# Altium schematic sheet TMS320F28379D.SchDoc
size Letter
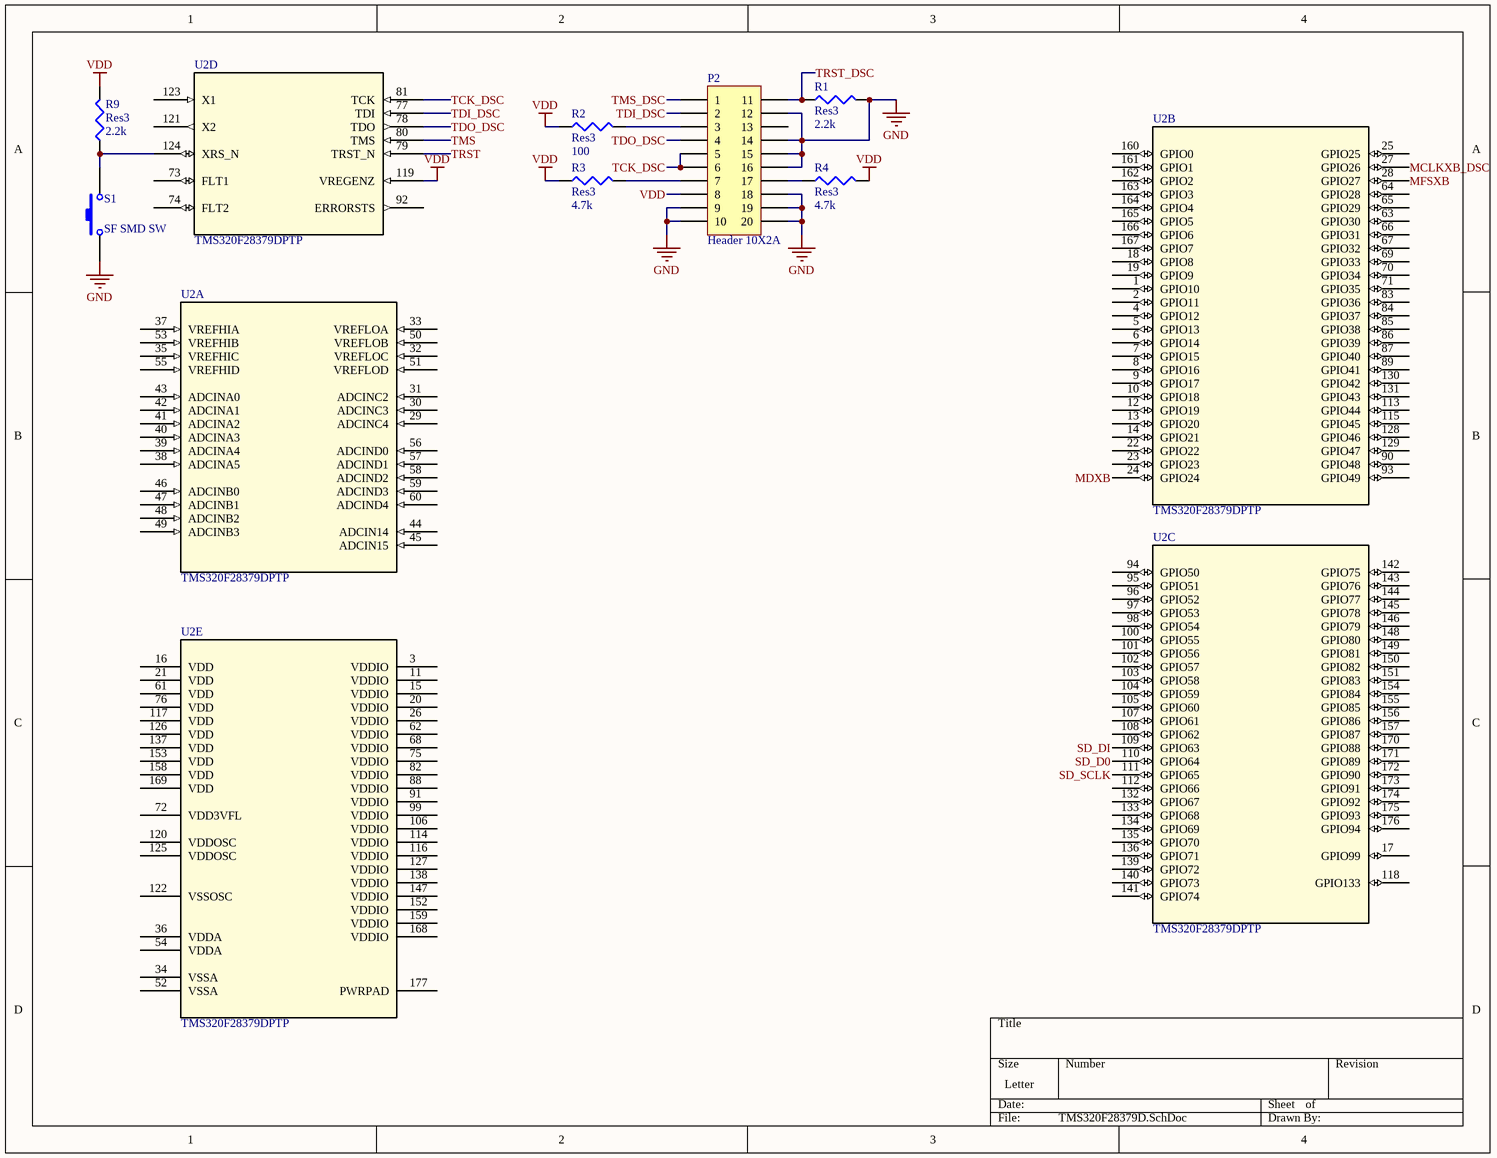
[diagram p0: TMS320F28379D.SchDoc]

## Parts
P2  Header 10X2A  [HDR2X10_CEN]
R1  Res3  value 2.2k  [J1-0603]
R2  Res3  value 100  [J1-0603]
R3  Res3  value 4.7k  [J1-0603]
R4  Res3  value 4.7k  [J1-0603]
R9  Res3  value 2.2k  [J1-0603]
S1  SF SMD SW  [SW_SMD]
U2  TMS320F28379DPTP  [PTP0176F_N]  (parts A,B,C,D,E of 5)

## Nets
GND: P2.9 P2.10 P2.12 P2.14 P2.15 P2.16 P2.18 P2.19 P2.20 R1.2 S1.1
VDD: P2.8 R2.1 R3.1 R4.2 R9.2 U2.119(VREGENZ)
MCLKXB_DSC: U2.27(GPIO26)
MDXB: U2.24(GPIO24)
MFSXB: U2.28(GPIO27)
SD_D0: U2.110(GPIO64)
SD_DI: U2.109(GPIO63)
SD_SCLK: U2.111(GPIO65)
TCK_DSC: P2.5 P2.6 U2.81(TCK)
TDI_DSC: P2.2 U2.77(TDI)
TDO_DSC: P2.4 U2.78(TDO)
TMS: U2.80(TMS)
TMS_DSC: P2.1
TRST: U2.79(TRST_N)
TRST_DSC: P2.11 R1.1
NetP2_3: P2.3 R2.2
NetP2_7: P2.7 R3.2
NetP2_17: P2.17 R4.1
NetR9_1: R9.1 S1.2 U2.124(XRS_N)

Not connected (* = marked no-connect by the designer): P2 13; U2 1(GPIO10) 2(GPIO11) 3(VDDIO) 4(GPIO12) 5(GPIO13) 6(GPIO14) 7(GPIO15) 8(GPIO16) 9(GPIO17) 10(GPIO18) 11(VDDIO) 12(GPIO19) 13(GPIO20) 14(GPIO21) 15(VDDIO) 16(VDD) 17(GPIO99) 18(GPIO8) 19(GPIO9) 20(VDDIO) 21(VDD) 22(GPIO22) 23(GPIO23) 25(GPIO25) 26(VDDIO) 29(ADCINC4) 30(ADCINC3) 31(ADCINC2) 32(VREFLOC) 33(VREFLOA) 34(VSSA) 35(VREFHIC) 36(VDDA) 37(VREFHIA) 38(ADCINA5) 39(ADCINA4) 40(ADCINA3) 41(ADCINA2) 42(ADCINA1) 43(ADCINA0) 44(ADCIN14) 45(ADCIN15) 46(ADCINB0) 47(ADCINB1) 48(ADCINB2) 49(ADCINB3) 50(VREFLOB) 51(VREFLOD) 52(VSSA) 53(VREFHIB) 54(VDDA) 55(VREFHID) 56(ADCIND0) 57(ADCIND1) 58(ADCIND2) 59(ADCIND3) 60(ADCIND4) 61(VDD) 62(VDDIO) 63(GPIO30) 64(GPIO28) 65(GPIO29) 66(GPIO31) 67(GPIO32) 68(VDDIO) 69(GPIO33) 70(GPIO34) 71(GPIO35) 72(VDD3VFL) 73(FLT1) 74(FLT2) 75(VDDIO) 76(VDD) 82(VDDIO) 83(GPIO36) 84(GPIO37) 85(GPIO38) 86(GPIO39) 87(GPIO40) 88(VDDIO) 89(GPIO41) 90(GPIO48) 91(VDDIO) 92(ERRORSTS) 93(GPIO49) 94(GPIO50) 95(GPIO51) 96(GPIO52) 97(GPIO53) 98(GPIO54) 99(VDDIO) 100(GPIO55) 101(GPIO56) 102(GPIO57) 103(GPIO58) 104(GPIO59) 105(GPIO60) 106(VDDIO) 107(GPIO61) 108(GPIO62) 112(GPIO66) 113(GPIO44) 114(VDDIO) 115(GPIO45) 116(VDDIO) 117(VDD) 118(GPIO133) 120(VDDOSC) 121(X2) 122(VSSOSC) 123(X1) 125(VDDOSC) 126(VDD) 127(VDDIO) 128(GPIO46) 129(GPIO47) 130(GPIO42) 131(GPIO43) 132(GPIO67) 133(GPIO68) 134(GPIO69) 135(GPIO70) 136(GPIO71) 137(VDD) 138(VDDIO) 139(GPIO72) 140(GPIO73) 141(GPIO74) 142(GPIO75) 143(GPIO76) 144(GPIO77) 145(GPIO78) 146(GPIO79) 147(VDDIO) 148(GPIO80) 149(GPIO81) 150(GPIO82) 151(GPIO83) 152(VDDIO) 153(VDD) 154(GPIO84) 155(GPIO85) 156(GPIO86) 157(GPIO87) 158(VDD) 159(VDDIO) 160(GPIO0) 161(GPIO1) 162(GPIO2) 163(GPIO3) 164(GPIO4) 165(GPIO5) 166(GPIO6) 167(GPIO7) 168(VDDIO) 169(VDD) 170(GPIO88) 171(GPIO89) 172(GPIO90) 173(GPIO91) 174(GPIO92) 175(GPIO93) 176(GPIO94) 177(PWRPAD)

## Library data of the parts
P2 = Header 10X2A: Header, 10-Pin, Dual row; LatestRevisionDate: 17-Jul-2002; LatestRevisionNote: Re-released for DXP Platform.; Publisher: Altium Limited
R1-R4 R9 = Res3: Resistor; Published: 8-Jun-2000; LatestRevisionDate: 29-May-2009; LatestRevisionNote: IPC-7351 Footprint Added.; PackageReference: J1-0603; Publisher: Altium Limited; PackageDescription: Chip Resistor
S1 = SW-PB_1: DIGIKEY SW400-ND; Published: 24-Mar-1999; LatestRevisionDate: 17-Jul-2002; LatestRevisionNote: Re-released for DXP Platform.; Publisher: Altium Limited
U2 = TMS320F28379DPTP: Imported; PartNumber: TMS320F28379DPTPS; Manufacturer: Texas Instruments; RefDes: RefDes; TYPE: TYPE; Value: Value